# Altium project slave-18-ltc6813-1.PrjPcb (part 1 of 3)
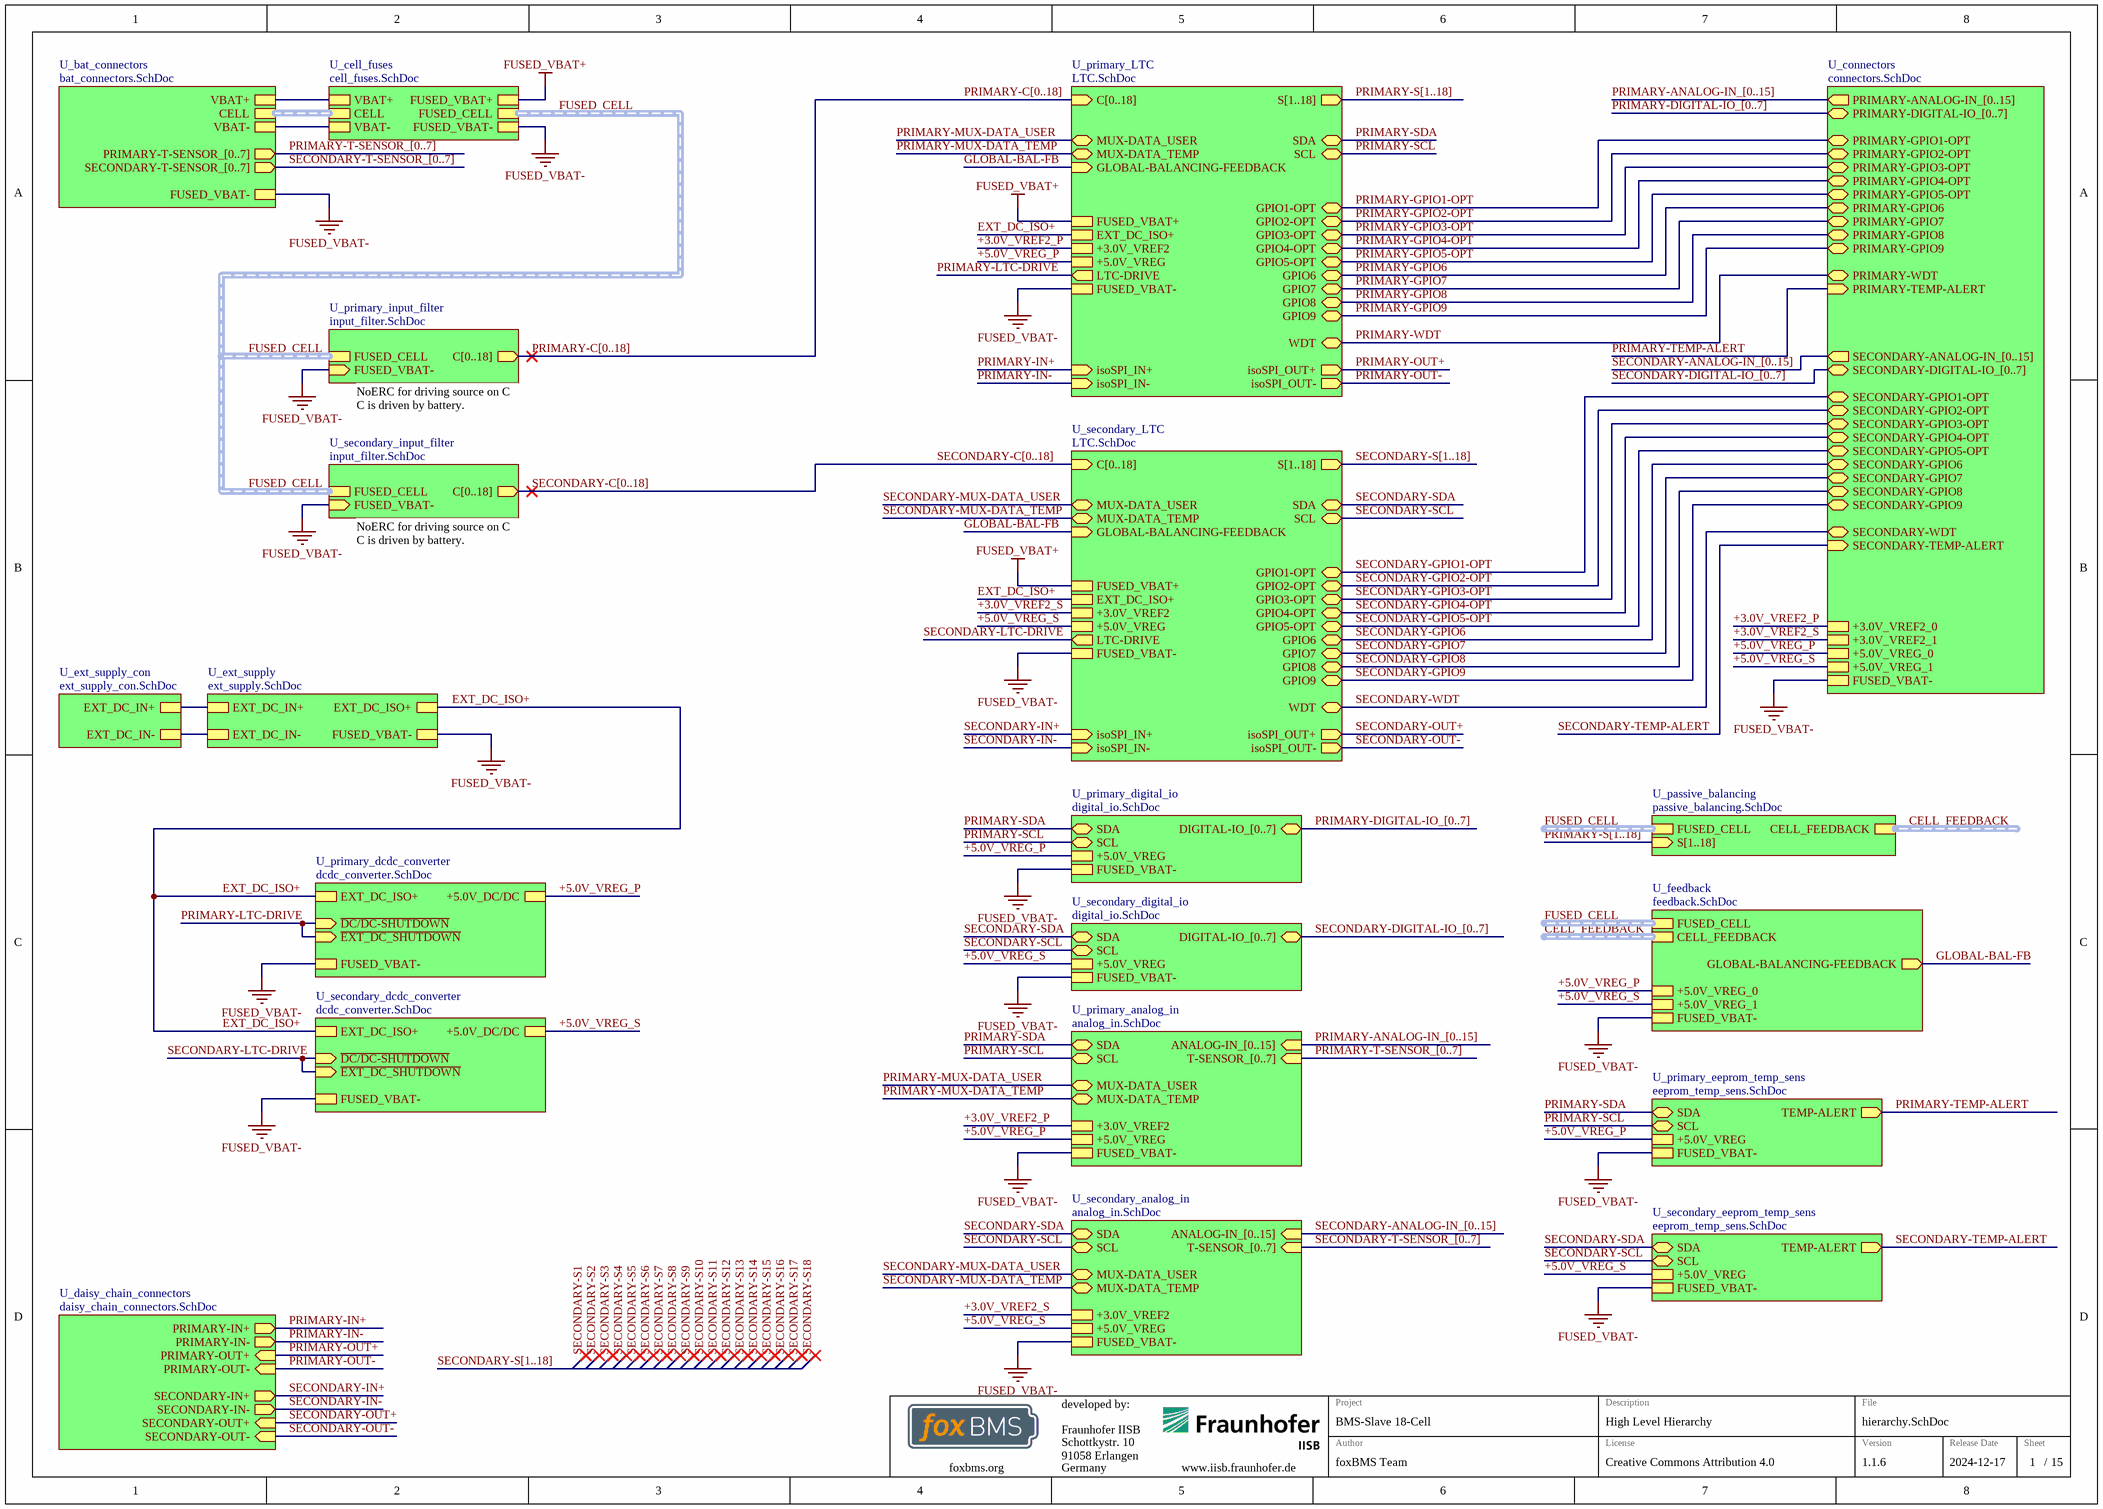
[diagram p0: hierarchy.SchDoc]
GlobalDate: 2024-12-17; GlobalLicense: Creative Commons Attribution 4.0; GlobalProject: BMS-Slave 18-Cell; GlobalVersion: 1.1.6
15 sheets, 578 parts. Net scope: strictly hierarchical (ports join the sheet entries above them; power ports are local).
Board file: slave.PcbDoc
Sheets:
  hierarchy.SchDoc
    U_cell_fuses = cell_fuses.SchDoc
    U_primary_input_filter = input_filter.SchDoc
    U_secondary_input_filter = input_filter.SchDoc
    U_ext_supply = ext_supply.SchDoc
    U_connectors = connectors.SchDoc
    U_feedback = feedback.SchDoc
    U_passive_balancing = passive_balancing.SchDoc
    U_primary_LTC = LTC.SchDoc
    U_secondary_digital_io = digital_io.SchDoc
    U_secondary_eeprom_temp_sens = eeprom_temp_sens.SchDoc
    U_secondary_analog_in = analog_in.SchDoc
    U_daisy_chain_connectors = daisy_chain_connectors.SchDoc
    U_ext_supply_con = ext_supply_con.SchDoc
    U_bat_connectors = bat_connectors.SchDoc
    U_primary_dcdc_converter = dcdc_converter.SchDoc
    U_secondary_dcdc_converter = dcdc_converter.SchDoc
    U_secondary_LTC = LTC.SchDoc
    U_primary_digital_io = digital_io.SchDoc
    U_primary_eeprom_temp_sens = eeprom_temp_sens.SchDoc
    U_primary_analog_in = analog_in.SchDoc

## Sheet hierarchy.SchDoc
size A3; SheetNumber: 1; SheetTotal: 15; SheetDescription: High Level Hierarchy

### Sub-sheets
U_bat_connectors = bat_connectors.SchDoc: CELL (harness CELL_VOLTAGES), PRIMARY-T-SENSOR_[0..7] (out), SECONDARY-T-SENSOR_[0..7] (out), VBAT+, VBAT-, FUSED_VBAT-
U_cell_fuses = cell_fuses.SchDoc: FUSED_CELL (harness CELL_VOLTAGES), CELL (harness CELL_VOLTAGES), VBAT+, VBAT-, FUSED_VBAT+, FUSED_VBAT-
U_connectors = connectors.SchDoc: PRIMARY-WDT (bidir), SECONDARY-WDT (bidir), PRIMARY-GPIO1-OPT (bidir), PRIMARY-GPIO2-OPT (bidir), PRIMARY-GPIO3-OPT (bidir), PRIMARY-GPIO4-OPT (bidir), PRIMARY-GPIO5-OPT (bidir), SECONDARY-GPIO1-OPT (bidir), SECONDARY-GPIO2-OPT (bidir), SECONDARY-GPIO3-OPT (bidir), SECONDARY-GPIO4-OPT (bidir), SECONDARY-GPIO5-OPT (bidir), PRIMARY-TEMP-ALERT (in), SECONDARY-TEMP-ALERT (in), SECONDARY-DIGITAL-IO_[0..7] (bidir), PRIMARY-DIGITAL-IO_[0..7] (bidir), PRIMARY-ANALOG-IN_[0..15] (out), SECONDARY-ANALOG-IN_[0..15] (out), PRIMARY-GPIO9 (bidir), PRIMARY-GPIO7 (bidir), PRIMARY-GPIO6 (bidir), PRIMARY-GPIO8 (bidir), SECONDARY-GPIO9 (bidir), SECONDARY-GPIO8 (bidir), SECONDARY-GPIO7 (bidir), SECONDARY-GPIO6 (bidir), +3.0V_VREF2_1, +5.0V_VREG_1, +3.0V_VREF2_0, FUSED_VBAT-, +5.0V_VREG_0
U_daisy_chain_connectors = daisy_chain_connectors.SchDoc: SECONDARY-IN+ (out), SECONDARY-IN- (out), SECONDARY-OUT+ (in), SECONDARY-OUT- (in), PRIMARY-IN+ (out), PRIMARY-IN- (out), PRIMARY-OUT- (in), PRIMARY-OUT+ (in)
U_ext_supply = ext_supply.SchDoc: EXT_DC_IN+, EXT_DC_IN-, EXT_DC_ISO+, FUSED_VBAT-
U_ext_supply_con = ext_supply_con.SchDoc: EXT_DC_IN+, EXT_DC_IN-
U_feedback = feedback.SchDoc: GLOBAL-BALANCING-FEEDBACK (out), CELL_FEEDBACK (harness CELL_FEEDBACK), FUSED_CELL (harness CELL_VOLTAGES), +5.0V_VREG_1, +5.0V_VREG_0, FUSED_VBAT-
U_passive_balancing = passive_balancing.SchDoc: FUSED_CELL (harness CELL_VOLTAGES), S[1..18] (in), CELL_FEEDBACK (harness CELL_FEEDBACK)
U_primary_analog_in = analog_in.SchDoc: MUX-DATA_TEMP (bidir), MUX-DATA_USER (bidir), ANALOG-IN_[0..15] (in), T-SENSOR_[0..7] (in), SCL (bidir), SDA (bidir), +5.0V_VREG, FUSED_VBAT-, +3.0V_VREF2
U_primary_dcdc_converter = dcdc_converter.SchDoc: +5.0V_DC/DC, FUSED_VBAT-, ~{DC/DC-SHUTDOWN} (in), EXT_DC_ISO+, ~{EXT_DC_SHUTDOWN} (in)
U_primary_digital_io = digital_io.SchDoc: SCL (bidir), SDA (bidir), DIGITAL-IO_[0..7] (bidir), +5.0V_VREG, FUSED_VBAT-
U_primary_eeprom_temp_sens = eeprom_temp_sens.SchDoc: TEMP-ALERT (out), SDA (bidir), SCL (bidir), FUSED_VBAT-, +5.0V_VREG
U_primary_input_filter = input_filter.SchDoc: FUSED_CELL (harness CELL_VOLTAGES), C[0..18] (out), FUSED_VBAT- (in)
U_primary_LTC = LTC.SchDoc: isoSPI_IN- (in), isoSPI_IN+ (in), isoSPI_OUT- (out), isoSPI_OUT+ (out), GPIO5-OPT (bidir), GPIO4-OPT (bidir), MUX-DATA_USER (bidir), GPIO1-OPT (bidir), SCL (bidir), GPIO2-OPT (bidir), MUX-DATA_TEMP (bidir), GPIO3-OPT (bidir), GLOBAL-BALANCING-FEEDBACK (in), SDA (bidir), EXT_DC_ISO+, C[0..18] (in), S[1..18] (out), WDT (bidir), GPIO8 (bidir), GPIO7 (bidir), GPIO9 (bidir), GPIO6 (bidir), FUSED_VBAT+, FUSED_VBAT-, +5.0V_VREG, +3.0V_VREF2, LTC-DRIVE (out)
U_secondary_analog_in = analog_in.SchDoc: MUX-DATA_TEMP (bidir), MUX-DATA_USER (bidir), ANALOG-IN_[0..15] (in), T-SENSOR_[0..7] (in), SCL (bidir), SDA (bidir), +5.0V_VREG, FUSED_VBAT-, +3.0V_VREF2
U_secondary_dcdc_converter = dcdc_converter.SchDoc: +5.0V_DC/DC, FUSED_VBAT-, ~{DC/DC-SHUTDOWN} (in), EXT_DC_ISO+, ~{EXT_DC_SHUTDOWN} (in)
U_secondary_digital_io = digital_io.SchDoc: SCL (bidir), SDA (bidir), DIGITAL-IO_[0..7] (bidir), +5.0V_VREG, FUSED_VBAT-
U_secondary_eeprom_temp_sens = eeprom_temp_sens.SchDoc: TEMP-ALERT (out), SDA (bidir), SCL (bidir), FUSED_VBAT-, +5.0V_VREG
U_secondary_input_filter = input_filter.SchDoc: FUSED_CELL (harness CELL_VOLTAGES), C[0..18] (out), FUSED_VBAT- (in)
U_secondary_LTC = LTC.SchDoc: isoSPI_IN- (in), isoSPI_IN+ (in), isoSPI_OUT- (out), isoSPI_OUT+ (out), GPIO5-OPT (bidir), GPIO4-OPT (bidir), MUX-DATA_USER (bidir), GPIO1-OPT (bidir), SCL (bidir), GPIO2-OPT (bidir), MUX-DATA_TEMP (bidir), GPIO3-OPT (bidir), GLOBAL-BALANCING-FEEDBACK (in), SDA (bidir), EXT_DC_ISO+, C[0..18] (in), S[1..18] (out), WDT (bidir), GPIO8 (bidir), GPIO7 (bidir), GPIO9 (bidir), GPIO6 (bidir), FUSED_VBAT+, FUSED_VBAT-, +5.0V_VREG, +3.0V_VREF2, LTC-DRIVE (out)

### Nets
+3.0V_VREF2_P: sheet U_connectors/+3.0V_VREF2_0, sheet U_primary_LTC/+3.0V_VREF2, sheet U_primary_analog_in/+3.0V_VREF2  [project net +3.0V_VREF2]
+3.0V_VREF2_S: sheet U_connectors/+3.0V_VREF2_1, sheet U_secondary_analog_in/+3.0V_VREF2, sheet U_secondary_LTC/+3.0V_VREF2  [project net +3.0V_VREF2]
+5.0V_VREG_P: sheet U_connectors/+5.0V_VREG_0, sheet U_feedback/+5.0V_VREG_0, sheet U_primary_LTC/+5.0V_VREG, sheet U_primary_dcdc_converter/+5.0V_DC/DC, sheet U_primary_digital_io/+5.0V_VREG, sheet U_primary_eeprom_temp_sens/+5.0V_VREG, sheet U_primary_analog_in/+5.0V_VREG  [project net +5.0V_VREG]
+5.0V_VREG_S: sheet U_connectors/+5.0V_VREG_1, sheet U_feedback/+5.0V_VREG_1, sheet U_secondary_digital_io/+5.0V_VREG, sheet U_secondary_eeprom_temp_sens/+5.0V_VREG, sheet U_secondary_analog_in/+5.0V_VREG, sheet U_secondary_dcdc_converter/+5.0V_DC/DC, sheet U_secondary_LTC/+5.0V_VREG  [project net +5.0V_VREG]
FUSED_VBAT+: sheet U_cell_fuses/FUSED_VBAT+, sheet U_primary_LTC/FUSED_VBAT+, sheet U_secondary_LTC/FUSED_VBAT+
FUSED_VBAT-: sheet U_cell_fuses/FUSED_VBAT-, sheet U_primary_input_filter/FUSED_VBAT-, sheet U_secondary_input_filter/FUSED_VBAT-, sheet U_ext_supply/FUSED_VBAT-, sheet U_connectors/FUSED_VBAT-, sheet U_feedback/FUSED_VBAT-, sheet U_primary_LTC/FUSED_VBAT-, sheet U_secondary_digital_io/FUSED_VBAT-, sheet U_secondary_eeprom_temp_sens/FUSED_VBAT-, sheet U_secondary_analog_in/FUSED_VBAT-, sheet U_bat_connectors/FUSED_VBAT-, sheet U_primary_dcdc_converter/FUSED_VBAT-, sheet U_secondary_dcdc_converter/FUSED_VBAT-, sheet U_secondary_LTC/FUSED_VBAT-, sheet U_primary_digital_io/FUSED_VBAT-, sheet U_primary_eeprom_temp_sens/FUSED_VBAT-, sheet U_primary_analog_in/FUSED_VBAT-
VBAT+: sheet U_cell_fuses/VBAT+, sheet U_bat_connectors/VBAT+
VBAT-: sheet U_cell_fuses/VBAT-, sheet U_bat_connectors/VBAT-
EXT_DC_IN+: sheet U_ext_supply/EXT_DC_IN+, sheet U_ext_supply_con/EXT_DC_IN+
EXT_DC_IN-: sheet U_ext_supply/EXT_DC_IN-, sheet U_ext_supply_con/EXT_DC_IN-
EXT_DC_ISO+: sheet U_ext_supply/EXT_DC_ISO+, sheet U_primary_LTC/EXT_DC_ISO+, sheet U_primary_dcdc_converter/EXT_DC_ISO+, sheet U_secondary_dcdc_converter/EXT_DC_ISO+, sheet U_secondary_LTC/EXT_DC_ISO+
GLOBAL-BAL-FB: sheet U_feedback/GLOBAL-BALANCING-FEEDBACK, sheet U_primary_LTC/GLOBAL-BALANCING-FEEDBACK, sheet U_secondary_LTC/GLOBAL-BALANCING-FEEDBACK
PRIMARY-GPIO1-OPT: sheet U_connectors/PRIMARY-GPIO1-OPT, sheet U_primary_LTC/GPIO1-OPT
PRIMARY-GPIO2-OPT: sheet U_connectors/PRIMARY-GPIO2-OPT, sheet U_primary_LTC/GPIO2-OPT
PRIMARY-GPIO3-OPT: sheet U_connectors/PRIMARY-GPIO3-OPT, sheet U_primary_LTC/GPIO3-OPT
PRIMARY-GPIO4-OPT: sheet U_connectors/PRIMARY-GPIO4-OPT, sheet U_primary_LTC/GPIO4-OPT
PRIMARY-GPIO5-OPT: sheet U_connectors/PRIMARY-GPIO5-OPT, sheet U_primary_LTC/GPIO5-OPT
PRIMARY-GPIO6: sheet U_connectors/PRIMARY-GPIO6, sheet U_primary_LTC/GPIO6
PRIMARY-GPIO7: sheet U_connectors/PRIMARY-GPIO7, sheet U_primary_LTC/GPIO7
PRIMARY-GPIO8: sheet U_connectors/PRIMARY-GPIO8, sheet U_primary_LTC/GPIO8
PRIMARY-GPIO9: sheet U_connectors/PRIMARY-GPIO9, sheet U_primary_LTC/GPIO9
PRIMARY-IN+: sheet U_primary_LTC/isoSPI_IN+, sheet U_daisy_chain_connectors/PRIMARY-IN+
PRIMARY-IN-: sheet U_primary_LTC/isoSPI_IN-, sheet U_daisy_chain_connectors/PRIMARY-IN-
PRIMARY-LTC-DRIVE: sheet U_primary_LTC/LTC-DRIVE, sheet U_primary_dcdc_converter/~{DC/DC-SHUTDOWN}, sheet U_primary_dcdc_converter/~{EXT_DC_SHUTDOWN}
PRIMARY-MUX-DATA_TEMP: sheet U_primary_LTC/MUX-DATA_TEMP, sheet U_primary_analog_in/MUX-DATA_TEMP
PRIMARY-MUX-DATA_USER: sheet U_primary_LTC/MUX-DATA_USER, sheet U_primary_analog_in/MUX-DATA_USER
PRIMARY-OUT+: sheet U_primary_LTC/isoSPI_OUT+, sheet U_daisy_chain_connectors/PRIMARY-OUT+
PRIMARY-OUT-: sheet U_primary_LTC/isoSPI_OUT-, sheet U_daisy_chain_connectors/PRIMARY-OUT-
PRIMARY-SCL: sheet U_primary_LTC/SCL, sheet U_primary_digital_io/SCL, sheet U_primary_eeprom_temp_sens/SCL, sheet U_primary_analog_in/SCL
PRIMARY-SDA: sheet U_primary_LTC/SDA, sheet U_primary_digital_io/SDA, sheet U_primary_eeprom_temp_sens/SDA, sheet U_primary_analog_in/SDA
PRIMARY-TEMP-ALERT: sheet U_connectors/PRIMARY-TEMP-ALERT, sheet U_primary_eeprom_temp_sens/TEMP-ALERT
PRIMARY-WDT: sheet U_connectors/PRIMARY-WDT, sheet U_primary_LTC/WDT
SECONDARY-GPIO1-OPT: sheet U_connectors/SECONDARY-GPIO1-OPT, sheet U_secondary_LTC/GPIO1-OPT
SECONDARY-GPIO2-OPT: sheet U_connectors/SECONDARY-GPIO2-OPT, sheet U_secondary_LTC/GPIO2-OPT
SECONDARY-GPIO3-OPT: sheet U_connectors/SECONDARY-GPIO3-OPT, sheet U_secondary_LTC/GPIO3-OPT
SECONDARY-GPIO4-OPT: sheet U_connectors/SECONDARY-GPIO4-OPT, sheet U_secondary_LTC/GPIO4-OPT
SECONDARY-GPIO5-OPT: sheet U_connectors/SECONDARY-GPIO5-OPT, sheet U_secondary_LTC/GPIO5-OPT
SECONDARY-GPIO6: sheet U_connectors/SECONDARY-GPIO6, sheet U_secondary_LTC/GPIO6
SECONDARY-GPIO7: sheet U_connectors/SECONDARY-GPIO7, sheet U_secondary_LTC/GPIO7
SECONDARY-GPIO8: sheet U_connectors/SECONDARY-GPIO8, sheet U_secondary_LTC/GPIO8
SECONDARY-GPIO9: sheet U_connectors/SECONDARY-GPIO9, sheet U_secondary_LTC/GPIO9
SECONDARY-IN+: sheet U_daisy_chain_connectors/SECONDARY-IN+, sheet U_secondary_LTC/isoSPI_IN+
SECONDARY-IN-: sheet U_daisy_chain_connectors/SECONDARY-IN-, sheet U_secondary_LTC/isoSPI_IN-
SECONDARY-LTC-DRIVE: sheet U_secondary_dcdc_converter/~{DC/DC-SHUTDOWN}, sheet U_secondary_dcdc_converter/~{EXT_DC_SHUTDOWN}, sheet U_secondary_LTC/LTC-DRIVE
SECONDARY-MUX-DATA_TEMP: sheet U_secondary_analog_in/MUX-DATA_TEMP, sheet U_secondary_LTC/MUX-DATA_TEMP
SECONDARY-MUX-DATA_USER: sheet U_secondary_analog_in/MUX-DATA_USER, sheet U_secondary_LTC/MUX-DATA_USER
SECONDARY-OUT+: sheet U_daisy_chain_connectors/SECONDARY-OUT+, sheet U_secondary_LTC/isoSPI_OUT+
SECONDARY-OUT-: sheet U_daisy_chain_connectors/SECONDARY-OUT-, sheet U_secondary_LTC/isoSPI_OUT-
SECONDARY-SCL: sheet U_secondary_digital_io/SCL, sheet U_secondary_eeprom_temp_sens/SCL, sheet U_secondary_analog_in/SCL, sheet U_secondary_LTC/SCL
SECONDARY-SDA: sheet U_secondary_digital_io/SDA, sheet U_secondary_eeprom_temp_sens/SDA, sheet U_secondary_analog_in/SDA, sheet U_secondary_LTC/SDA
SECONDARY-TEMP-ALERT: sheet U_connectors/SECONDARY-TEMP-ALERT, sheet U_secondary_eeprom_temp_sens/TEMP-ALERT
SECONDARY-WDT: sheet U_connectors/SECONDARY-WDT, sheet U_secondary_LTC/WDT

### Buses and harness runs
bus PRIMARY-ANALOG-IN_[0..15] = sheet U_connectors/PRIMARY-ANALOG-IN_[0..15]
bus PRIMARY-ANALOG-IN_[0..15] = sheet U_primary_analog_in/ANALOG-IN_[0..15]
bus PRIMARY-C[0..18] = sheet U_primary_input_filter/C[0..18] = sheet U_primary_LTC/C[0..18]
bus PRIMARY-DIGITAL-IO_[0..7] = sheet U_connectors/PRIMARY-DIGITAL-IO_[0..7]
bus PRIMARY-DIGITAL-IO_[0..7] = sheet U_primary_digital_io/DIGITAL-IO_[0..7]
bus PRIMARY-S[1..18] = sheet U_passive_balancing/S[1..18]
bus PRIMARY-S[1..18] = sheet U_primary_LTC/S[1..18]
bus PRIMARY-T-SENSOR_[0..7] = sheet U_bat_connectors/PRIMARY-T-SENSOR_[0..7]
bus PRIMARY-T-SENSOR_[0..7] = sheet U_primary_analog_in/T-SENSOR_[0..7]
bus SECONDARY-ANALOG-IN_[0..15] = sheet U_connectors/SECONDARY-ANALOG-IN_[0..15]
bus SECONDARY-ANALOG-IN_[0..15] = sheet U_secondary_analog_in/ANALOG-IN_[0..15]
bus SECONDARY-C[0..18] = sheet U_secondary_input_filter/C[0..18] = sheet U_secondary_LTC/C[0..18]
bus SECONDARY-DIGITAL-IO_[0..7] = sheet U_connectors/SECONDARY-DIGITAL-IO_[0..7]
bus SECONDARY-DIGITAL-IO_[0..7] = sheet U_secondary_digital_io/DIGITAL-IO_[0..7]
bus SECONDARY-S[1..18]
bus SECONDARY-S[1..18] = sheet U_secondary_LTC/S[1..18]
bus SECONDARY-T-SENSOR_[0..7] = sheet U_bat_connectors/SECONDARY-T-SENSOR_[0..7]
bus SECONDARY-T-SENSOR_[0..7] = sheet U_secondary_analog_in/T-SENSOR_[0..7]
harness CELL_FEEDBACK = sheet U_feedback/CELL_FEEDBACK
harness CELL_FEEDBACK = sheet U_passive_balancing/CELL_FEEDBACK
harness FUSED_CELL = sheet U_cell_fuses/FUSED_CELL = sheet U_primary_input_filter/FUSED_CELL = sheet U_secondary_input_filter/FUSED_CELL
harness FUSED_CELL = sheet U_feedback/FUSED_CELL
harness FUSED_CELL = sheet U_passive_balancing/FUSED_CELL
harness sheet U_bat_connectors/CELL = sheet U_cell_fuses/CELL

### Notes on the sheet
- NoERC for driving source on C
  C is driven by battery.
- Labels drawn without touching a wire or pin: SECONDARY-S1, SECONDARY-S2, SECONDARY-S3, SECONDARY-S4, SECONDARY-S5, SECONDARY-S6, SECONDARY-S7, SECONDARY-S8, SECONDARY-S9, SECONDARY-S10, SECONDARY-S11, SECONDARY-S12, SECONDARY-S13, SECONDARY-S14, SECONDARY-S15, SECONDARY-S16, SECONDARY-S17, SECONDARY-S18
- Fraunhofer IISB
- Schottkystr. 10
- developed by:
- 91058 Erlangen
- Germany
- Author
- Project
- License
- Description
- File
- Version
- Release Date
- Sheet
- foxbms.org <https://foxbms.org>
- www.iisb.fraunhofer.de <https://www.iisb.fraunhofer.de/>
- foxBMS Team
- /

## Sheet cell_fuses.SchDoc
size A3; SheetNumber: 3; SheetTotal: 15; SheetDescription: Cell Fuses
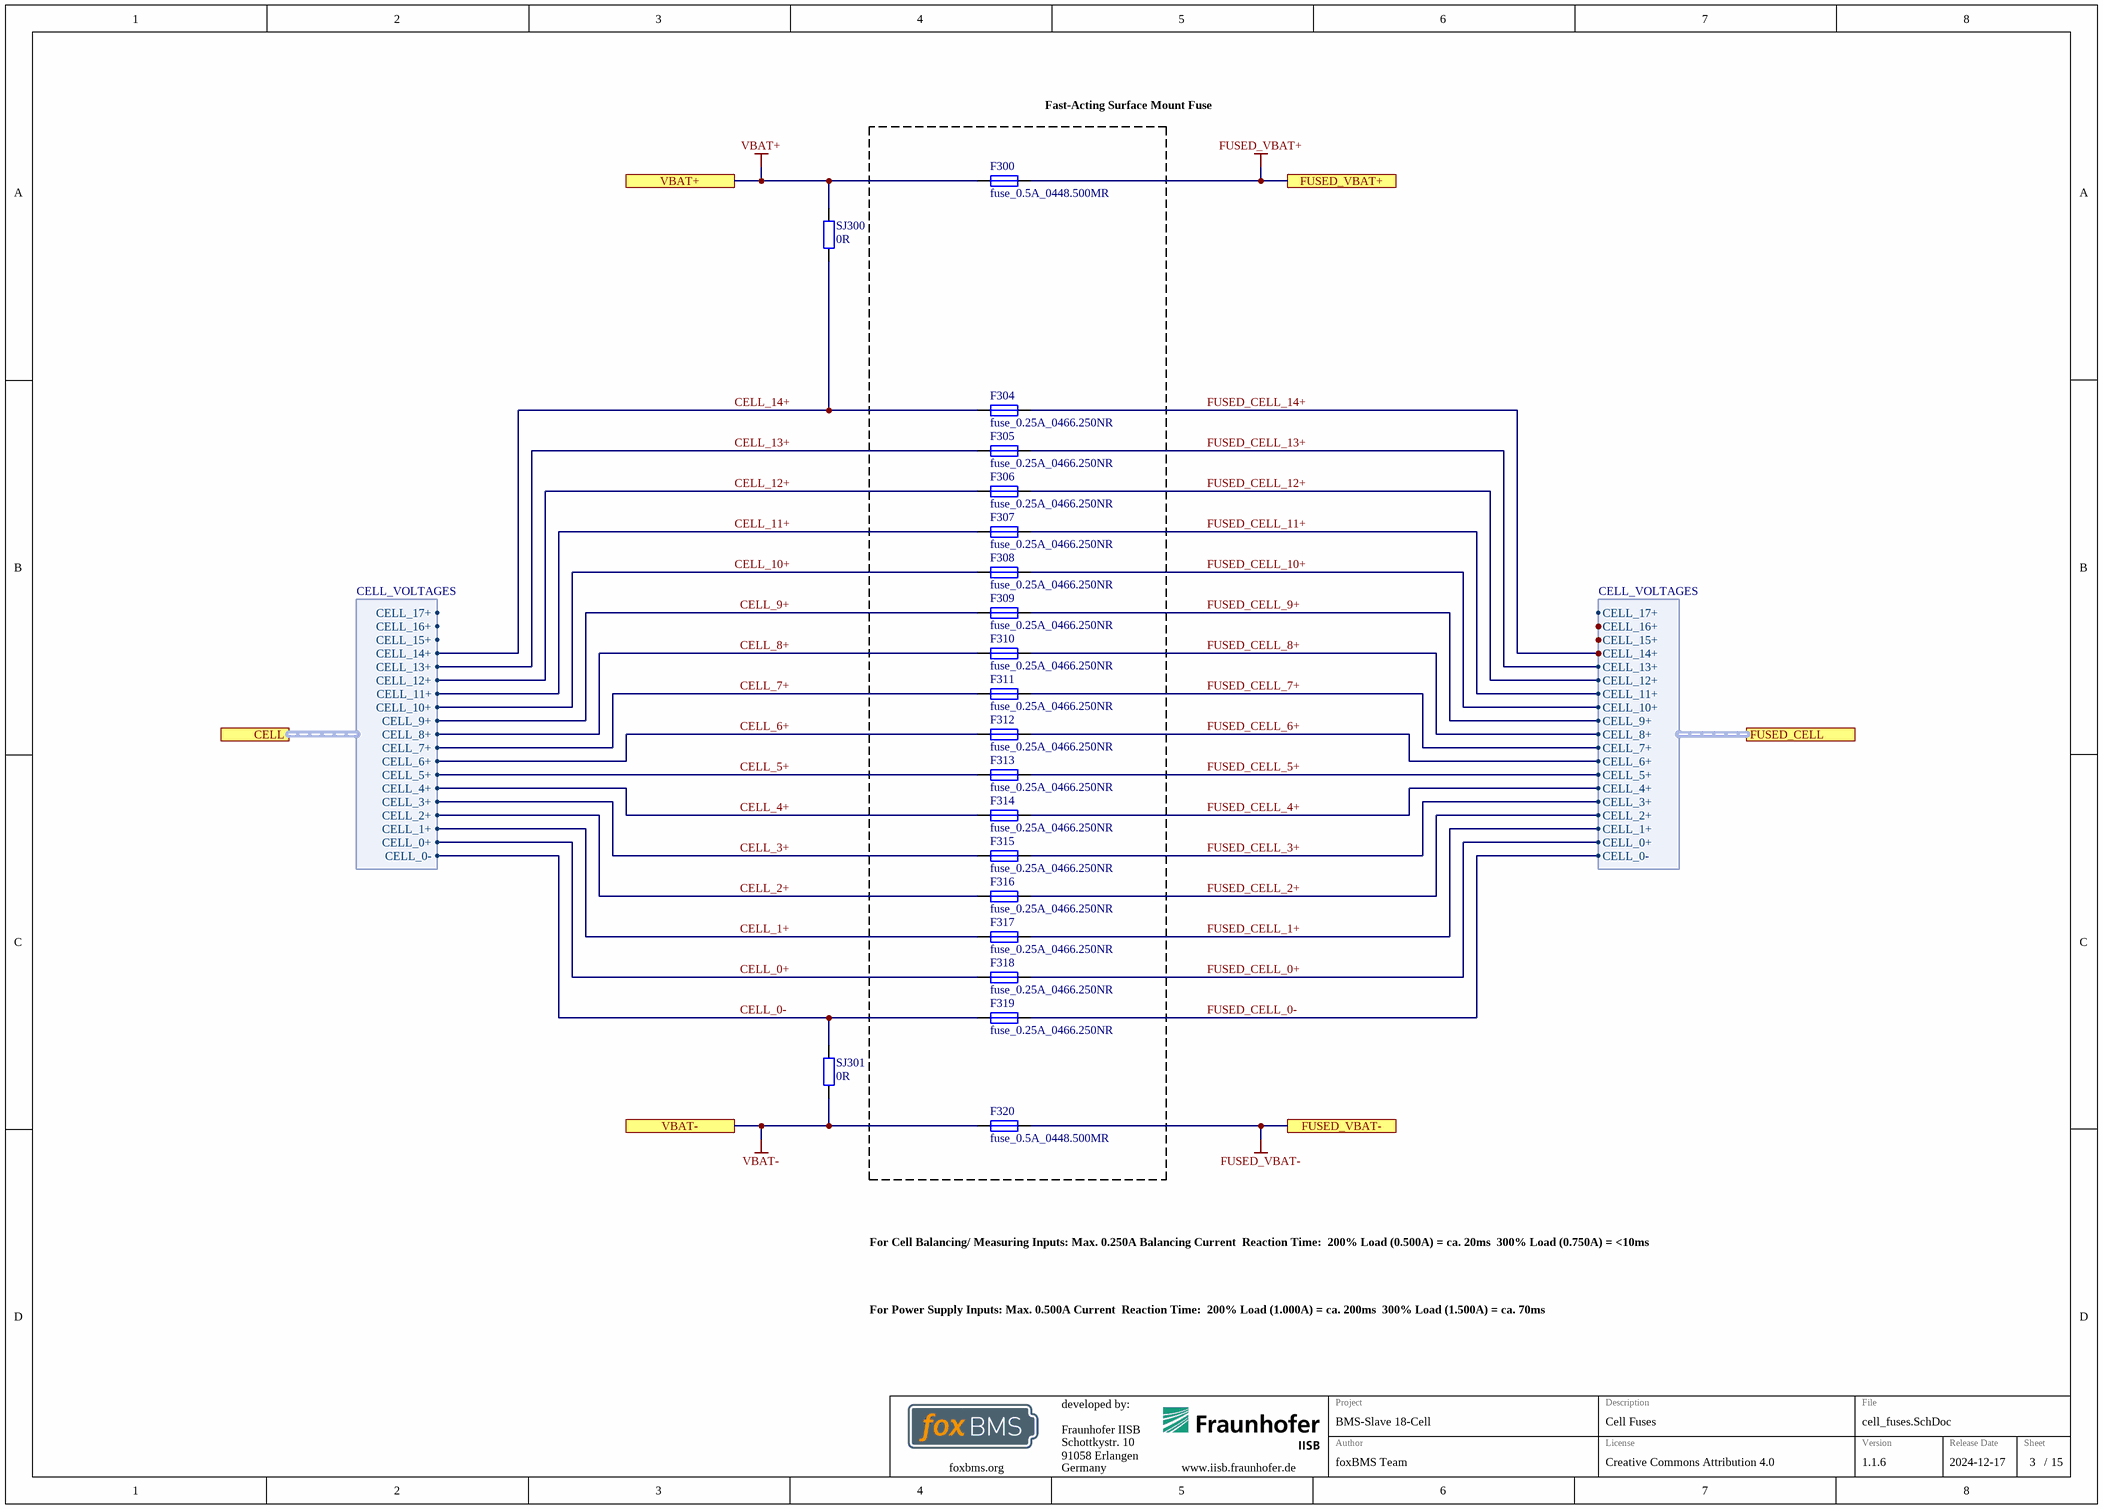
[diagram p1: cell_fuses.SchDoc]

### Parts
F300  fuse_0.5A_0448.500MR  [LITTLEFUSE_448]
F304  fuse_0.25A_0466.250NR  [LITTLEFUSE_466]
F305  fuse_0.25A_0466.250NR  [LITTLEFUSE_466]
F306  fuse_0.25A_0466.250NR  [LITTLEFUSE_466]
F307  fuse_0.25A_0466.250NR  [LITTLEFUSE_466]
F308  fuse_0.25A_0466.250NR  [LITTLEFUSE_466]
F309  fuse_0.25A_0466.250NR  [LITTLEFUSE_466]
F310  fuse_0.25A_0466.250NR  [LITTLEFUSE_466]
F311  fuse_0.25A_0466.250NR  [LITTLEFUSE_466]
F312  fuse_0.25A_0466.250NR  [LITTLEFUSE_466]
F313  fuse_0.25A_0466.250NR  [LITTLEFUSE_466]
F314  fuse_0.25A_0466.250NR  [LITTLEFUSE_466]
F315  fuse_0.25A_0466.250NR  [LITTLEFUSE_466]
F316  fuse_0.25A_0466.250NR  [LITTLEFUSE_466]
F317  fuse_0.25A_0466.250NR  [LITTLEFUSE_466]
F318  fuse_0.25A_0466.250NR  [LITTLEFUSE_466]
F319  fuse_0.25A_0466.250NR  [LITTLEFUSE_466]
F320  fuse_0.5A_0448.500MR  [LITTLEFUSE_448]
SJ300  0R  [RESC1608X05N]
SJ301  0R  [RESC1608X05N]

### Blocks framed on the sheet
Fast-Acting Surface Mount Fuse: F300 F304-F320

### Ports
CELL (harness CELL_VOLTAGES), FUSED_CELL (harness CELL_VOLTAGES), FUSED_VBAT+, FUSED_VBAT-, VBAT+, VBAT-

### Harnesses
CELL_VOLTAGES: CELL_0-, CELL_0+, CELL_1+, CELL_10+, CELL_11+, CELL_12+, CELL_13+, CELL_14+, CELL_15+, CELL_16+, CELL_17+, CELL_2+, CELL_3+, CELL_4+, CELL_5+, CELL_6+, CELL_7+, CELL_8+, CELL_9+

### Nets
FUSED_VBAT+: F300.2 ; port FUSED_VBAT+
FUSED_VBAT-: F320.2 ; port FUSED_VBAT-
VBAT+: F300.1 SJ300.1 ; port VBAT+
VBAT-: F320.1 SJ301.2 ; port VBAT-
CELL_0+: F318.1 ; port CELL.CELL_0+
CELL_0-: F319.1 SJ301.1 ; port CELL.CELL_0-
CELL_1+: F317.1 ; port CELL.CELL_1+
CELL_2+: F316.1 ; port CELL.CELL_2+
CELL_3+: F315.1 ; port CELL.CELL_3+
CELL_4+: F314.1 ; port CELL.CELL_4+
CELL_5+: F313.1 ; port CELL.CELL_5+
CELL_6+: F312.1 ; port CELL.CELL_6+
CELL_7+: F311.1 ; port CELL.CELL_7+
CELL_8+: F310.1 ; port CELL.CELL_8+
CELL_9+: F309.1 ; port CELL.CELL_9+
CELL_10+: F308.1 ; port CELL.CELL_10+
CELL_11+: F307.1 ; port CELL.CELL_11+
CELL_12+: F306.1 ; port CELL.CELL_12+
CELL_13+: F305.1 ; port CELL.CELL_13+
CELL_14+: F304.1 SJ300.2 ; port CELL.CELL_14+
FUSED_CELL_0+: F318.2 ; port FUSED_CELL.CELL_0+  [project net FUSED_CELL.CELL_0+]
FUSED_CELL_0-: F319.2 ; port FUSED_CELL.CELL_0-  [project net FUSED_CELL.CELL_0-]
FUSED_CELL_1+: F317.2 ; port FUSED_CELL.CELL_1+  [project net FUSED_CELL.CELL_1+]
FUSED_CELL_2+: F316.2 ; port FUSED_CELL.CELL_2+  [project net FUSED_CELL.CELL_2+]
FUSED_CELL_3+: F315.2 ; port FUSED_CELL.CELL_3+  [project net FUSED_CELL.CELL_3+]
FUSED_CELL_4+: F314.2 ; port FUSED_CELL.CELL_4+  [project net FUSED_CELL.CELL_4+]
FUSED_CELL_5+: F313.2 ; port FUSED_CELL.CELL_5+  [project net FUSED_CELL.CELL_5+]
FUSED_CELL_6+: F312.2 ; port FUSED_CELL.CELL_6+  [project net FUSED_CELL.CELL_6+]
FUSED_CELL_7+: F311.2 ; port FUSED_CELL.CELL_7+  [project net FUSED_CELL.CELL_7+]
FUSED_CELL_8+: F310.2 ; port FUSED_CELL.CELL_8+  [project net FUSED_CELL.CELL_8+]
FUSED_CELL_9+: F309.2 ; port FUSED_CELL.CELL_9+  [project net FUSED_CELL.CELL_9+]
FUSED_CELL_10+: F308.2 ; port FUSED_CELL.CELL_10+  [project net FUSED_CELL.CELL_10+]
FUSED_CELL_11+: F307.2 ; port FUSED_CELL.CELL_11+  [project net FUSED_CELL.CELL_11+]
FUSED_CELL_12+: F306.2 ; port FUSED_CELL.CELL_12+  [project net FUSED_CELL.CELL_12+]
FUSED_CELL_13+: F305.2 ; port FUSED_CELL.CELL_13+  [project net FUSED_CELL.CELL_13+]
FUSED_CELL_14+: F304.2 ; port FUSED_CELL.CELL_14+, port FUSED_CELL.CELL_15+, port FUSED_CELL.CELL_16+, port FUSED_CELL.CELL_17+  [project net FUSED_CELL.CELL_14+]

### Notes on the sheet
- For Cell Balancing/ Measuring Inputs: Max. 0.250A Balancing Current
  Reaction Time:
  200% Load (0.500A) = ca. 20ms
  300% Load (0.750A) = <10ms
- For Power Supply Inputs: Max. 0.500A Current
  Reaction Time:
  200% Load (1.000A) = ca. 200ms
  300% Load (1.500A) = ca. 70ms
- Fraunhofer IISB
- Schottkystr. 10
- developed by:
- 91058 Erlangen
- Germany
- Author
- Project
- License
- Description
- File
- Version
- Release Date
- Sheet
- foxbms.org <https://foxbms.org>
- www.iisb.fraunhofer.de <https://www.iisb.fraunhofer.de/>
- foxBMS Team
- /

### Library data of the parts
F300 F320 = fuse_0.5A_0448.500MR: Fuse, Surface Mount, NANO2 Series, 500 mA, 125 VAC, 32 VDC, Very Fast Acting, SMD; Manufacturer: Littlefuse; Automotive Qualified: False; Part Number: fuse_0.5A_0448.500MR; Operating Temperature: -55°C - +125°C; ComponentLink1Description: Datasheet; ComponentLink1URL: http://www.farnell.com/datasheets/1792947.pdf; Supplier 1: Farnell; Supplier Part Number 1: 1596919
F304-F319 = fuse_0.25A_0466.250NR: Fuse, Surface Mount, 466 Series, 250 mA, 125 VAC, 125 VDC, Very Fast Acting, 1206; Manufacturer: Littlefuse; Automotive Qualified: False; Part Number: fuse_0.25A_0466.250NR; Operating Temperature: -55°C - +90°C; ComponentLink1Description: Datasheet; ComponentLink1URL: http://www.farnell.com/datasheets/1796765.pdf; Supplier 1: Farnell; Supplier Part Number 1: 9921826
SJ300 SJ301 = gen_R_0R_0603: SMD Resistor 0R 0603; Power: 0.1W; Case EIA: 0603; Case Metric: 1608; Maximum Working Voltage: 75V; PnP Package: R_0603; Automotive Qualified: True; Part Number: gen_R_0R_0603; Operating Temperature: -55°C - +155°C; Resistance: 0R; Series: Jumper; PnP Value: 0R; Supplier 1: Farnell; Supplier Part Number 1: 2616580

## Sheet input_filter.SchDoc
size A3; SheetNumber: 4; SheetTotal: 15; SheetDescription: Input Filter
Used 2 times, as channels U_primary_input_filter, U_secondary_input_filter. Parts and nets are listed once, with the designators drawn on the sheet.
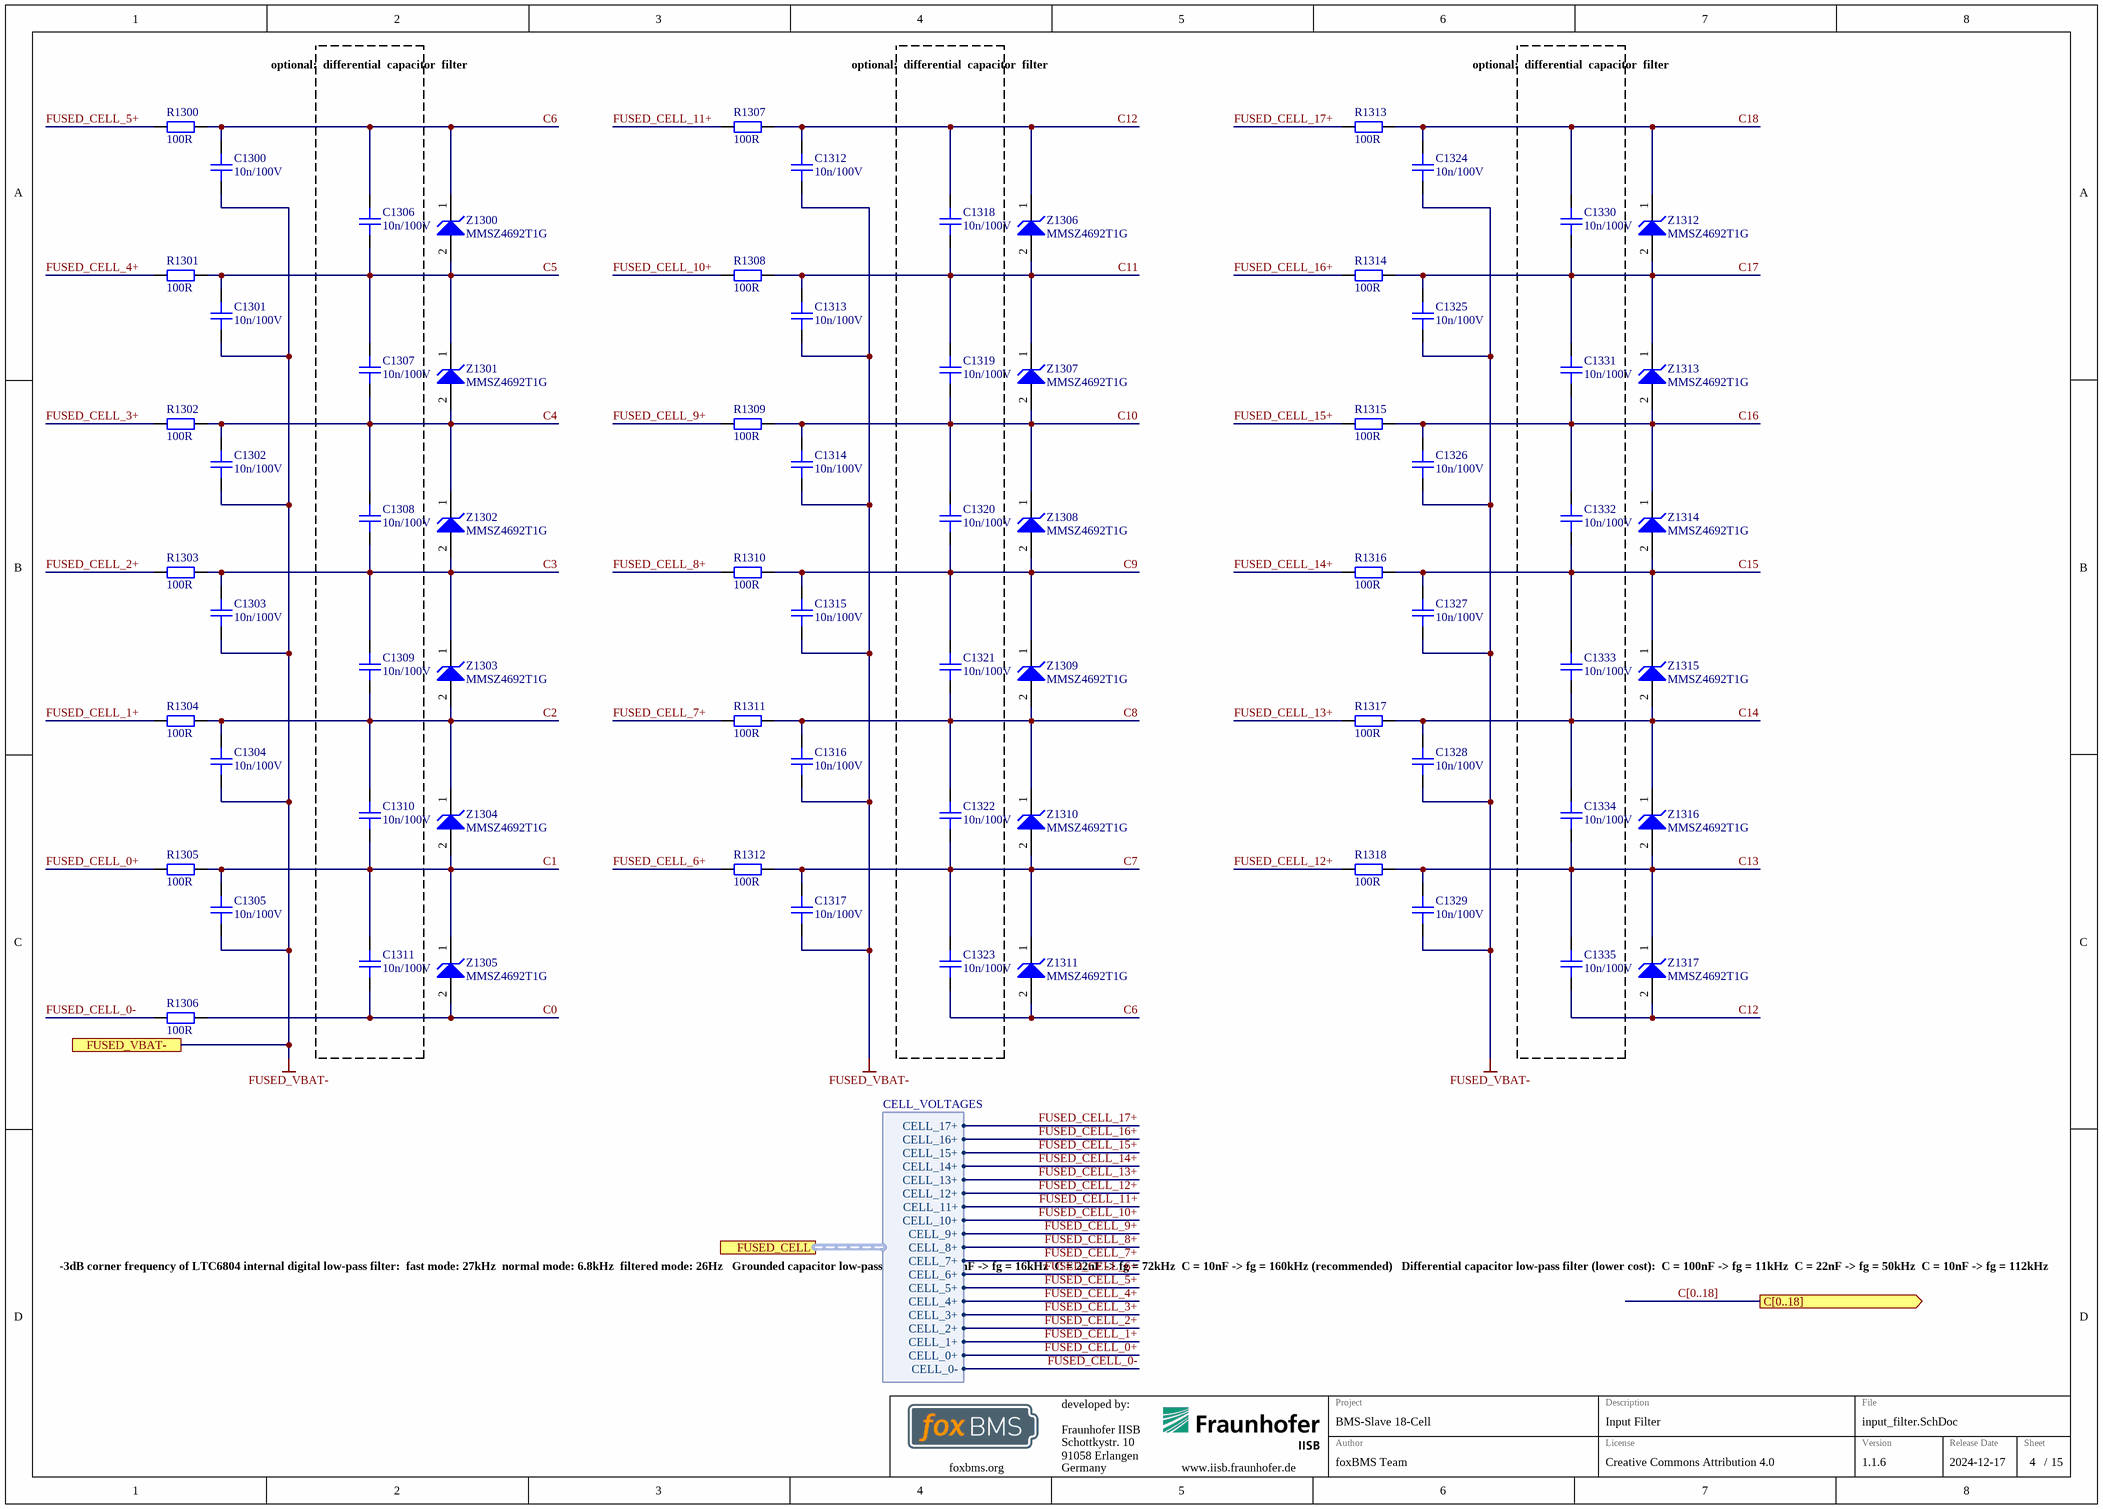
[diagram p2: input_filter.SchDoc]

### Parts
C1300  10n/100V  [CAPC1608X08N]
C1301  10n/100V  [CAPC1608X08N]
C1302  10n/100V  [CAPC1608X08N]
C1303  10n/100V  [CAPC1608X08N]
C1304  10n/100V  [CAPC1608X08N]
C1305  10n/100V  [CAPC1608X08N]
C1306  10n/100V  [CAPC1608X08N]
C1307  10n/100V  [CAPC1608X08N]
C1308  10n/100V  [CAPC1608X08N]
C1309  10n/100V  [CAPC1608X08N]
C1310  10n/100V  [CAPC1608X08N]
C1311  10n/100V  [CAPC1608X08N]
C1312  10n/100V  [CAPC1608X08N]
C1313  10n/100V  [CAPC1608X08N]
C1314  10n/100V  [CAPC1608X08N]
C1315  10n/100V  [CAPC1608X08N]
C1316  10n/100V  [CAPC1608X08N]
C1317  10n/100V  [CAPC1608X08N]
C1318  10n/100V  [CAPC1608X08N]
C1319  10n/100V  [CAPC1608X08N]
C1320  10n/100V  [CAPC1608X08N]
C1321  10n/100V  [CAPC1608X08N]
C1322  10n/100V  [CAPC1608X08N]
C1323  10n/100V  [CAPC1608X08N]
C1324  10n/100V  [CAPC1608X08N]
C1325  10n/100V  [CAPC1608X08N]
C1326  10n/100V  [CAPC1608X08N]
C1327  10n/100V  [CAPC1608X08N]
C1328  10n/100V  [CAPC1608X08N]
C1329  10n/100V  [CAPC1608X08N]
C1330  10n/100V  [CAPC1608X08N]
C1331  10n/100V  [CAPC1608X08N]
C1332  10n/100V  [CAPC1608X08N]
C1333  10n/100V  [CAPC1608X08N]
C1334  10n/100V  [CAPC1608X08N]
C1335  10n/100V  [CAPC1608X08N]
R1300  100R  [RESC1608X05N]
R1301  100R  [RESC1608X05N]
R1302  100R  [RESC1608X05N]
R1303  100R  [RESC1608X05N]
R1304  100R  [RESC1608X05N]
R1305  100R  [RESC1608X05N]
R1306  100R  [RESC1608X05N]
R1307  100R  [RESC1608X05N]
R1308  100R  [RESC1608X05N]
R1309  100R  [RESC1608X05N]
R1310  100R  [RESC1608X05N]
R1311  100R  [RESC1608X05N]
R1312  100R  [RESC1608X05N]
R1313  100R  [RESC1608X05N]
R1314  100R  [RESC1608X05N]
R1315  100R  [RESC1608X05N]
R1316  100R  [RESC1608X05N]
R1317  100R  [RESC1608X05N]
R1318  100R  [RESC1608X05N]
Z1300  MMSZ4692T1G  [ONSC-SOD-123-2-425-04_V]
Z1301  MMSZ4692T1G  [ONSC-SOD-123-2-425-04_V]
Z1302  MMSZ4692T1G  [ONSC-SOD-123-2-425-04_V]
Z1303  MMSZ4692T1G  [ONSC-SOD-123-2-425-04_V]
Z1304  MMSZ4692T1G  [ONSC-SOD-123-2-425-04_V]
Z1305  MMSZ4692T1G  [ONSC-SOD-123-2-425-04_V]
Z1306  MMSZ4692T1G  [ONSC-SOD-123-2-425-04_V]
Z1307  MMSZ4692T1G  [ONSC-SOD-123-2-425-04_V]
Z1308  MMSZ4692T1G  [ONSC-SOD-123-2-425-04_V]
Z1309  MMSZ4692T1G  [ONSC-SOD-123-2-425-04_V]
Z1310  MMSZ4692T1G  [ONSC-SOD-123-2-425-04_V]
Z1311  MMSZ4692T1G  [ONSC-SOD-123-2-425-04_V]
Z1312  MMSZ4692T1G  [ONSC-SOD-123-2-425-04_V]
Z1313  MMSZ4692T1G  [ONSC-SOD-123-2-425-04_V]
Z1314  MMSZ4692T1G  [ONSC-SOD-123-2-425-04_V]
Z1315  MMSZ4692T1G  [ONSC-SOD-123-2-425-04_V]
Z1316  MMSZ4692T1G  [ONSC-SOD-123-2-425-04_V]
Z1317  MMSZ4692T1G  [ONSC-SOD-123-2-425-04_V]

### Blocks framed on the sheet
optional: / differential / capacitor / filter: C1306-C1311
optional: / differential / capacitor / filter: C1318-C1323
optional: / differential / capacitor / filter: C1330-C1335

### Ports
C[0..18] (out), FUSED_CELL (harness CELL_VOLTAGES), FUSED_VBAT-

### Harnesses
CELL_VOLTAGES: CELL_0-, CELL_0+, CELL_1+, CELL_10+, CELL_11+, CELL_12+, CELL_13+, CELL_14+, CELL_15+, CELL_16+, CELL_17+, CELL_2+, CELL_3+, CELL_4+, CELL_5+, CELL_6+, CELL_7+, CELL_8+, CELL_9+

### Nets
FUSED_VBAT-: C1300.2 C1301.2 C1302.2 C1303.2 C1304.2 C1305.2 C1312.2 C1313.2 C1314.2 C1315.2 C1316.2 C1317.2 C1324.2 C1325.2 C1326.2 C1327.2 C1328.2 C1329.2 ; port FUSED_VBAT-
C0: C1311.2 R1306.2 Z1305.2(A)
C1: C1305.1 C1310.2 C1311.1 R1305.2 Z1304.2(A) Z1305.1(K)
C2: C1304.1 C1309.2 C1310.1 R1304.2 Z1303.2(A) Z1304.1(K)
C3: C1303.1 C1308.2 C1309.1 R1303.2 Z1302.2(A) Z1303.1(K)
C4: C1302.1 C1307.2 C1308.1 R1302.2 Z1301.2(A) Z1302.1(K)
C5: C1301.1 C1306.2 C1307.1 R1301.2 Z1300.2(A) Z1301.1(K)
C6: C1300.1 C1306.1 C1323.2 R1300.2 Z1300.1(K) Z1311.2(A)
C7: C1317.1 C1322.2 C1323.1 R1312.2 Z1310.2(A) Z1311.1(K)
C8: C1316.1 C1321.2 C1322.1 R1311.2 Z1309.2(A) Z1310.1(K)
C9: C1315.1 C1320.2 C1321.1 R1310.2 Z1308.2(A) Z1309.1(K)
C10: C1314.1 C1319.2 C1320.1 R1309.2 Z1307.2(A) Z1308.1(K)
C11: C1313.1 C1318.2 C1319.1 R1308.2 Z1306.2(A) Z1307.1(K)
C12: C1312.1 C1318.1 C1335.2 R1307.2 Z1306.1(K) Z1317.2(A)
C13: C1329.1 C1334.2 C1335.1 R1318.2 Z1316.2(A) Z1317.1(K)
C14: C1328.1 C1333.2 C1334.1 R1317.2 Z1315.2(A) Z1316.1(K)
C15: C1327.1 C1332.2 C1333.1 R1316.2 Z1314.2(A) Z1315.1(K)
C16: C1326.1 C1331.2 C1332.1 R1315.2 Z1313.2(A) Z1314.1(K)
C17: C1325.1 C1330.2 C1331.1 R1314.2 Z1312.2(A) Z1313.1(K)
C18: C1324.1 C1330.1 R1313.2 Z1312.1(K)
FUSED_CELL_0+: R1305.1 ; port FUSED_CELL.CELL_0+
FUSED_CELL_0-: R1306.1 ; port FUSED_CELL.CELL_0-
FUSED_CELL_1+: R1304.1 ; port FUSED_CELL.CELL_1+
FUSED_CELL_2+: R1303.1 ; port FUSED_CELL.CELL_2+
FUSED_CELL_3+: R1302.1 ; port FUSED_CELL.CELL_3+
FUSED_CELL_4+: R1301.1 ; port FUSED_CELL.CELL_4+
FUSED_CELL_5+: R1300.1 ; port FUSED_CELL.CELL_5+
FUSED_CELL_6+: R1312.1 ; port FUSED_CELL.CELL_6+
FUSED_CELL_7+: R1311.1 ; port FUSED_CELL.CELL_7+
FUSED_CELL_8+: R1310.1 ; port FUSED_CELL.CELL_8+
FUSED_CELL_9+: R1309.1 ; port FUSED_CELL.CELL_9+
FUSED_CELL_10+: R1308.1 ; port FUSED_CELL.CELL_10+
FUSED_CELL_11+: R1307.1 ; port FUSED_CELL.CELL_11+
FUSED_CELL_12+: R1318.1 ; port FUSED_CELL.CELL_12+
FUSED_CELL_13+: R1317.1 ; port FUSED_CELL.CELL_13+
FUSED_CELL_14+: R1316.1 ; port FUSED_CELL.CELL_14+
FUSED_CELL_15+: R1315.1 ; port FUSED_CELL.CELL_15+
FUSED_CELL_16+: R1314.1 ; port FUSED_CELL.CELL_16+
FUSED_CELL_17+: R1313.1 ; port FUSED_CELL.CELL_17+

### Channels
U_primary_input_filter: designators end in _1; ports FUSED_VBAT-=FUSED_VBAT-
U_secondary_input_filter: designators end in _2; ports FUSED_VBAT-=FUSED_VBAT-

### Buses and harness runs
bus C[0..18] = port C[0..18]

### Notes on the sheet
- -3dB corner frequency of LTC6804 internal digital low-pass filter:
  fast mode: 27kHz
  normal mode: 6.8kHz
  filtered mode: 26Hz
  Grounded capacitor low-pass filter:
  C = 100nF -> fg = 16kHz
  C = 22nF -> fg = 72kHz
  C = 10nF -> fg = 160kHz (recommended)
  Differential capacitor low-pass filter (lower cost):
  C = 100nF -> fg = 11kHz
  C = 22nF -> fg = 50kHz
  C = 10nF -> fg = 112kHz
- Fraunhofer IISB
- Schottkystr. 10
- developed by:
- 91058 Erlangen
- Germany
- Author
- Project
- License
- Description
- File
- Version
- Release Date
- Sheet
- foxbms.org <https://foxbms.org>
- www.iisb.fraunhofer.de <https://www.iisb.fraunhofer.de/>
- foxBMS Team
- /

### Library data of the parts
C1300-C1335 = gen_C_ceramic_10n_100V_X7R_0603: MLCC; Capacitance: 10n; Rated Voltage: 100V; Dielectric: X7R; Case EIA: 0603; Case Metric: 1608; Automotive Qualified: True; Part Number: gen_C_ceramic_10n_100V_X7R_0603; Supplier 1: Farnell; Supplier Part Number 1: 1301715; Supplier 2: Farnell; Supplier Part Number 2: 2821192; Supplier 3: Farnell; Supplier Part Number 3: 2210878
R1300-R1318 = gen_R_100R_0603: SMD Resistor 100R 0603; Tolerance: 1%; Power: 0.1W; Case EIA: 0603; Case Metric: 1608; Maximum Working Voltage: 75V; PnP Package: R_0603; Automotive Qualified: True; Part Number: gen_R_100R_0603; Operating Temperature: -55°C - +155°C; Resistance: 100R; Series: E24, E96; PnP Value: 100R; Supplier 1: Farnell; Supplier Part Number 1: 2303059
Z1300-Z1317 = CMP-1060-00434-1: Zener Voltage Regulator, 500 mW, 2-Pin SOD-123, Pb-Free, Tape and Reel; Manufacturer: On Semiconductor; VZ Typ (V): 6.8; P Max (W): 0.5; ComponentLink2URL: http://www.onsemi.com/pub_link/Collateral/MMSZ4678T1-D.PDF; Mounting Technology: Surface Mount; DatasheetVersion: Rev. 9; ComponentLink1Description: Manufacturer URL; ComponentLink3URL: http://www.onsemi.com/pub_link/Collateral/425-04.PDF; PackageReference: SOD-123-2-425-04; ComponentLink2Description: Datasheet; RoHS: Pb-Free; Packing: Tape and Reel; ComponentLink1URL: http://www.onsemi.com/; PackageDescription: 2-Pin SOD, Body 1.6 x 2.69 mm; ComponentLink3Description: Package Specification; PartNumber: MMSZ4692T1G; PackageVersion: Rev. G, 10/2009

## Sheet ext_supply.SchDoc
size A3; SheetNumber: 11; SheetTotal: 15; SheetDescription: External Supply
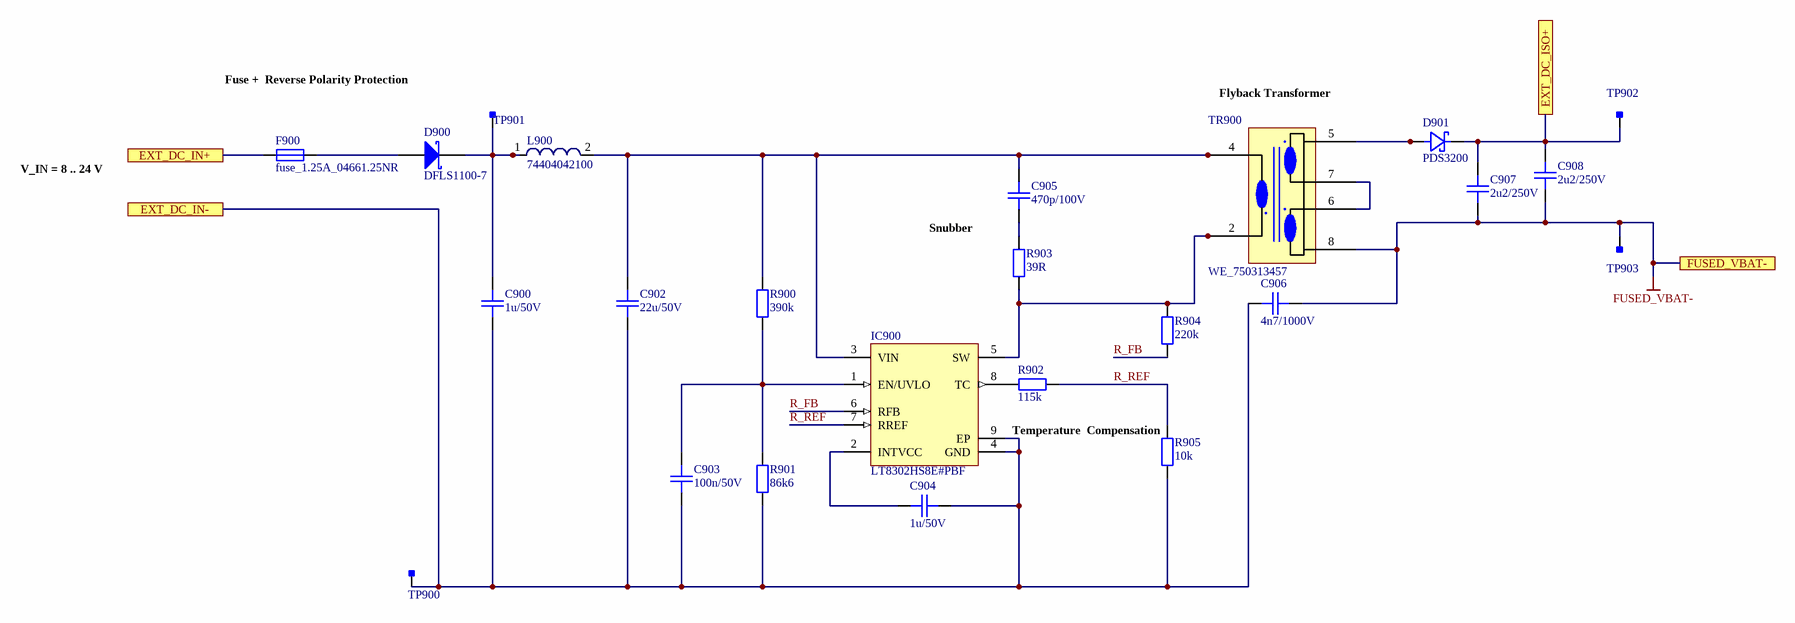
[diagram p3: ext_supply.SchDoc]

### Parts
C900  1u/50V  [CAPC2012X14N]
C902  22u/50V  [CAPC2220(5750)230_N]
C903  100n/50V  [CAPC1608X08N]
C904  1u/50V  [CAPC2012X14N]
C905  470p/100V  [CAPC2012X14N]
C906  4n7/1000V  [CAPC4532X16N]
C907  2u2/250V  [CAPC2220(5750)230_N]
C908  2u2/250V  [CAPC2220(5750)230_N]
D900  DFLS1100-7  [DIOD-POWERDI123-2_V]
D901  PDS3200  [PowerDI5]
F900  fuse_1.25A_04661.25NR  [LITTLEFUSE_466]
IC900  LT8302HS8E#PBF  [LT-S8E-8_V]
L900  74404042100  [WE-LQS 4018]
R900  390k  [RESC1608X05N]
R901  86k6  [RESC1608X05N]
R902  115k  [RESC1608X05N]
R903  39R  [RESC2012X05N]
R904  220k  [RESC1608X05N]
R905  10k  [RESC1608X05N]
TP900  Testpoint_Square  [Testpoint_S1]  (value not drawn)  (no BOM)
TP901  Testpoint_Square  [Testpoint_S1]  (value not drawn)  (no BOM)
TP902  Testpoint_Square  [Testpoint_S1]  (value not drawn)  (no BOM)
TP903  Testpoint_Square  [Testpoint_S1]  (value not drawn)  (no BOM)
TR900  WE_750313457  [WE_750313457]

### Ports
EXT_DC_IN+, EXT_DC_IN-, EXT_DC_ISO+, FUSED_VBAT-

### Nets
FUSED_VBAT-: C906.2 C907.1 C908.1 TP903.1 TR900.8 ; port FUSED_VBAT-
EXT_DC_IN+: F900.1 ; port EXT_DC_IN+
EXT_DC_IN-: C900.1 C902.1 C903.1 C904.1 C906.1 IC900.4(GND) IC900.9(EP) R901.1 R905.1 TP900.1 ; port EXT_DC_IN-
EXT_DC_ISO+: C907.2 C908.2 D901.1(C) TP902.1 ; port EXT_DC_ISO+
R_FB: IC900.6(RFB) R904.1
R_REF: IC900.7(RREF) R902.2 R905.2
NetC900_2: C900.2 D900.2(K) L900.1 TP901.1
NetC902_2: C902.2 C905.2 IC900.3(VIN) L900.2 R900.2 TR900.3 TR900.4
NetC903_2: C903.2 IC900.1(EN/UVLO) R900.1 R901.2
NetC904_2: C904.2 IC900.2(INTVCC)
NetC905_1: C905.1 R903.2
NetD900_1: D900.1(A) F900.2
NetD901_2: D901.2(A) D901.3(A) TR900.5
NetIC900_5: IC900.5(SW) R903.1 R904.2 TR900.1 TR900.2
NetIC900_8: IC900.8(TC) R902.1
NetTR900_6: TR900.6 TR900.7

### Notes on the sheet
- Fuse +
  Reverse Polarity Protection
- (near TR900) Flyback Transformer
- V_IN = 8 .. 24 V
- Snubber
- (near R905) Temperature
  Compensation
- Fraunhofer IISB
- Schottkystr. 10
- developed by:
- 91058 Erlangen
- Germany
- Author
- Project
- License
- Description
- File
- Version
- Release Date
- Sheet
- foxbms.org <https://foxbms.org>
- www.iisb.fraunhofer.de <https://www.iisb.fraunhofer.de/>
- foxBMS Team
- /

### Library data of the parts
C900 C904 = gen_C_ceramic_1u_50V_X7R_0805: MLCC; Capacitance: 1u; Rated Voltage: 50V; Dielectric: X7R; Case EIA: 0805; Case Metric: 2012; Automotive Qualified: True; Tolerance: ± 10%; AVT Set: x; Part Number: gen_C_ceramic_1u_50V_X7R_0805; Supplier 1: Farnell; Supplier Part Number 1: 2672199; Operating Temperature: -55°C - +125°C; Supplier 2: Farnell; Supplier Part Number 2: 2479894; Supplier 3: Farnell; Supplier Part Number 3: 2464630
C902 = gen_C_ceramic_22u_50V_X7R_2220_stacked: MLCC; Capacitance: 22u; Rated Voltage: 50V; Dielectric: X7R; Case EIA: 2220; Case Metric: 5750; Automotive Qualified: True; Part Number: gen_C_ceramic_22u_50V_X7R_2220_stacked; Supplier 1: Digikey; Supplier Part Number 1: 399-5797-1-ND
C903 = gen_C_ceramic_100n_50V_X7R_0603: MLCC; Capacitance: 100n; Rated Voltage: 50V; Dielectric: X7R; Case EIA: 0603; Case Metric: 1608; PnP Package: C_0603_10; PnP Value: 100n/50V/X7R; PnP equipped: x; Automotive Qualified: True; Part Number: gen_C_ceramic_100n_50V_X7R_0603; Supplier 1: Farnell; Supplier Part Number 1: 2525267; Supplier 2: Digikey; Supplier Part Number 2: 490-6049-1-ND; Supplier 3: Farnell; Supplier Part Number 3: 2070398
C905 = gen_C_ceramic_470p_100V_X7R_0805: MLCC; Capacitance: 470p; Rated Voltage: 100V; Dielectric: X7R; Case EIA: 0805; Case Metric: 2012; Automotive Qualified: True; Part Number: gen_C_ceramic_470p_100V_X7R_0805; Supplier 1: Farnell; Supplier Part Number 1: 2070482
C906 = gen_C_ceramic_4n7_1000V_X7R_1812: MLCC; Capacitance: 4n7; Rated Voltage: 1000V; Dielectric: X7R; Case EIA: 1812; Case Metric: 4532; Automotive Qualified: True; Part Number: gen_C_ceramic_4n7_1000V_X7R_1812; Supplier 1: Farnell; Supplier Part Number 1: 2834565
C907 C908 = gen_C_ceramic_2u2_250V_X7R_2220: MLCC; Capacitance: 2u2; Rated Voltage: 250V; Dielectric: X7R; Case EIA: 2220; Case Metric: 5750; Automotive Qualified: True; Part Number: gen_C_ceramic_2u2_250V_X7R_2220; Supplier 1: Digikey; Supplier Part Number 1: 445-7997-2-ND
D900 = CMP-2000-05099-1: 1 A High Voltage Schottky Barrier Rectifier, 0.62 V, -55 to 175 degC, 2- Pin POWERDI123, Pb-Free, Tape and Reel; Manufacturer: Diodes Inc; Average Rectified Current-Max: 1A; Peak Current-Max: 40A; Forward Voltage: 0.77V; Reverse Current-Max: 1µA; Reverse Voltage-Max [Vrrm]: 100V; Datasheet Version: Sep-14; Datasheet URL: https://datasheet.ciiva.com/15144/getdatasheetpartid-44146-15144126.pdf; Manufacturer URL: http://www.diodes.com/
D901 = PDS3200-13: Schottky Diode 3A 200V 780mV; Manufacturer: DIODES Inc; Automotive Qualified: True; Part Number: PDS3200-13; Part Name: PDS3200; Operating Temperature: -65°C - +150°C; Breakdown Voltage: 200V; Continuous Forward Current: 3A; ComponentLink1Description: Datasheet; ComponentLink1URL: http://www.farnell.com/datasheets/2238298.pdf; Supplier 1: Farnell; Supplier Part Number 1: 1713904
F900 = fuse_1.25A_04661.25NR: Fuse, Surface Mount, 466 Series, 1.25 A, 63 VAC, 63 VDC, Very Fast Acting, 1206; Manufacturer: Littlefuse; Automotive Qualified: False; Part Number: fuse_1.25A_04661.25NR; Operating Temperature: -55°C - +90°C; ComponentLink1Description: Datasheet; ComponentLink1URL: http://www.farnell.com/datasheets/1796765.pdf; Supplier 1: Farnell; Supplier Part Number 1: 1596526
IC900 = CMP-0492-02715-1: Micropower No-Opto Isolated Flyback Converter, 2.8 to 42 V, -40 to 150 degC, 8-Pin SOIC (S8E), RoHS, Tube; PartNumber: LT8302; Output Current: 3.6 A; Number of Outputs: 1; VIN Min: 2.8 V; VIN Max: 42 V; ComponentLink2Description: Datasheet; Temperature Min: -40 degC; PackageDescription: 8-Pin Plastic Small Outline Integrated Circuit Package, Body 4.90 x 3.90 mm, Pitch 1.27 mm; Temperature Max: 150 degC; ComponentLink1URL: http://www.linear.com/; ComponentLink3URL: http://cds.linear.com/docs/en/packaging/05081857_A_S8E.pdf; PackageVersion: Rev. A, 10/2013; Packing: Tube; RoHS: TRUE; DatasheetVersion: Rev. A; ComponentLink2URL: http://cds.linear.com/docs/en/datasheet/8302fa.pdf; Mounting Technology: Surface Mount; ComponentLink1Description: Manufacturer URL; ComponentLink3Description: Package Specification
L900 = CMP-1354-00028-1: WE-LQS SMD Power Inductor, L=10 µH; Manufacturer: Wuerth Elektronik; Inductance: 10 ÂµH; ComponentLink2URL: http://katalog.we-online.de/pbs/datasheet/74404042100.pdf; PartNumber: 74404042100; ComponentLink2Description: Datasheet; PackageReference: WE-LQS 4018; ComponentLink1URL: http://www.we-online.com; ComponentLink1Description: Manufacturer URL
R900 = gen_R_390k_0603: SMD Resistor 390k 0603; Tolerance: 1%; Power: 0.1W; Case EIA: 0603; Case Metric: 1608; Maximum Working Voltage: 75V; PnP Package: R_0603; Automotive Qualified: True; Part Number: gen_R_390k_0603; Operating Temperature: -55°C - +155°C; Resistance: 390k; Series: E24; PnP Value: 390k; Supplier 1: Farnell; Supplier Part Number 1: 2303278
R901 = gen_R_86k6_0603: SMD Resistor 86k6 0603; Tolerance: 1%; Power: 0.1W; Case EIA: 0603; Case Metric: 1608; Maximum Working Voltage: 75V; PnP Package: R_0603; Automotive Qualified: True; Part Number: gen_R_86k6_0603; Operating Temperature: -55°C - +155°C; Resistance: 86k6; Series: E96; PnP Value: 86k6; Supplier 1: Farnell; Supplier Part Number 1: 2059490
R902 = gen_R_115k_0603: SMD Resistor 115k 0603; Tolerance: 1%; Power: 0.1W; Case EIA: 0603; Case Metric: 1608; Maximum Working Voltage: 75V; PnP Package: R_0603; Automotive Qualified: True; Part Number: gen_R_115k_0603; Operating Temperature: -55°C - +155°C; Resistance: 115k; Series: E96; PnP Value: 115k; Supplier 1: Farnell; Supplier Part Number 1: 2073367
R903 = gen_R_39R_0805: SMD Resistor 39R 0805; Tolerance: 1%; Power: 0.125W; Case EIA: 0805; Case Metric: 2012; Maximum Working Voltage: 150V; PnP Package: R_0805; Automotive Qualified: True; Part Number: gen_R_39R_0805; Operating Temperature: -55°C - +155°C; Resistance: 39R; Series: E24; PnP Value: 39R; Supplier 1: Farnell; Supplier Part Number 1: 1750736
R904 = gen_R_220k_0603: SMD Resistor 220k 0603; Tolerance: 1%; Power: 0.1W; Case EIA: 0603; Case Metric: 1608; Maximum Working Voltage: 75V; PnP Package: R_0603; Automotive Qualified: False; Part Number: gen_R_220k_0603; Operating Temperature: -55°C - +155°C; Resistance: 220k; Series: E24; PnP Value: 220k
R905 = gen_R_10k_0603: SMD Resistor 10k 0603; Tolerance: 1%; Power: 0.1W; Case EIA: 0603; Case Metric: 1608; Maximum Working Voltage: 75V; PnP Package: R_0603; Automotive Qualified: True; Part Number: gen_R_10k_0603; Operating Temperature: -55°C - +155°C; Resistance: 10k; Series: E24, E96; PnP Value: 10k; Supplier 1: Farnell; Supplier Part Number 1: 2073349
TP900-TP903 = Testpoint_Square: Testpoint, square; Part Number: Testpoint_Square
TR900 = WE_750313457: MID-FLYLT Flyback Transformers for Linear Technology; Manufacturer: Würth Elektronik; Automotive Qualified: False; Part Number: WE_750313457; ComponentLink1Description: Datasheet; ComponentLink1URL: http://katalog.we-online.de/ctm/datasheet/750313457.pdf; ComponentLink2Description: Website; ComponentLink2URL: http://katalog.we-online.de/en/ctm/MID-FLYLT/750313457; Supplier 1: Digikey; Supplier Part Number 1: 1297-1136-1-ND

## Sheet connectors.SchDoc
size A3; SheetNumber: 10; SheetTotal: 15; SheetDescription: Connectors
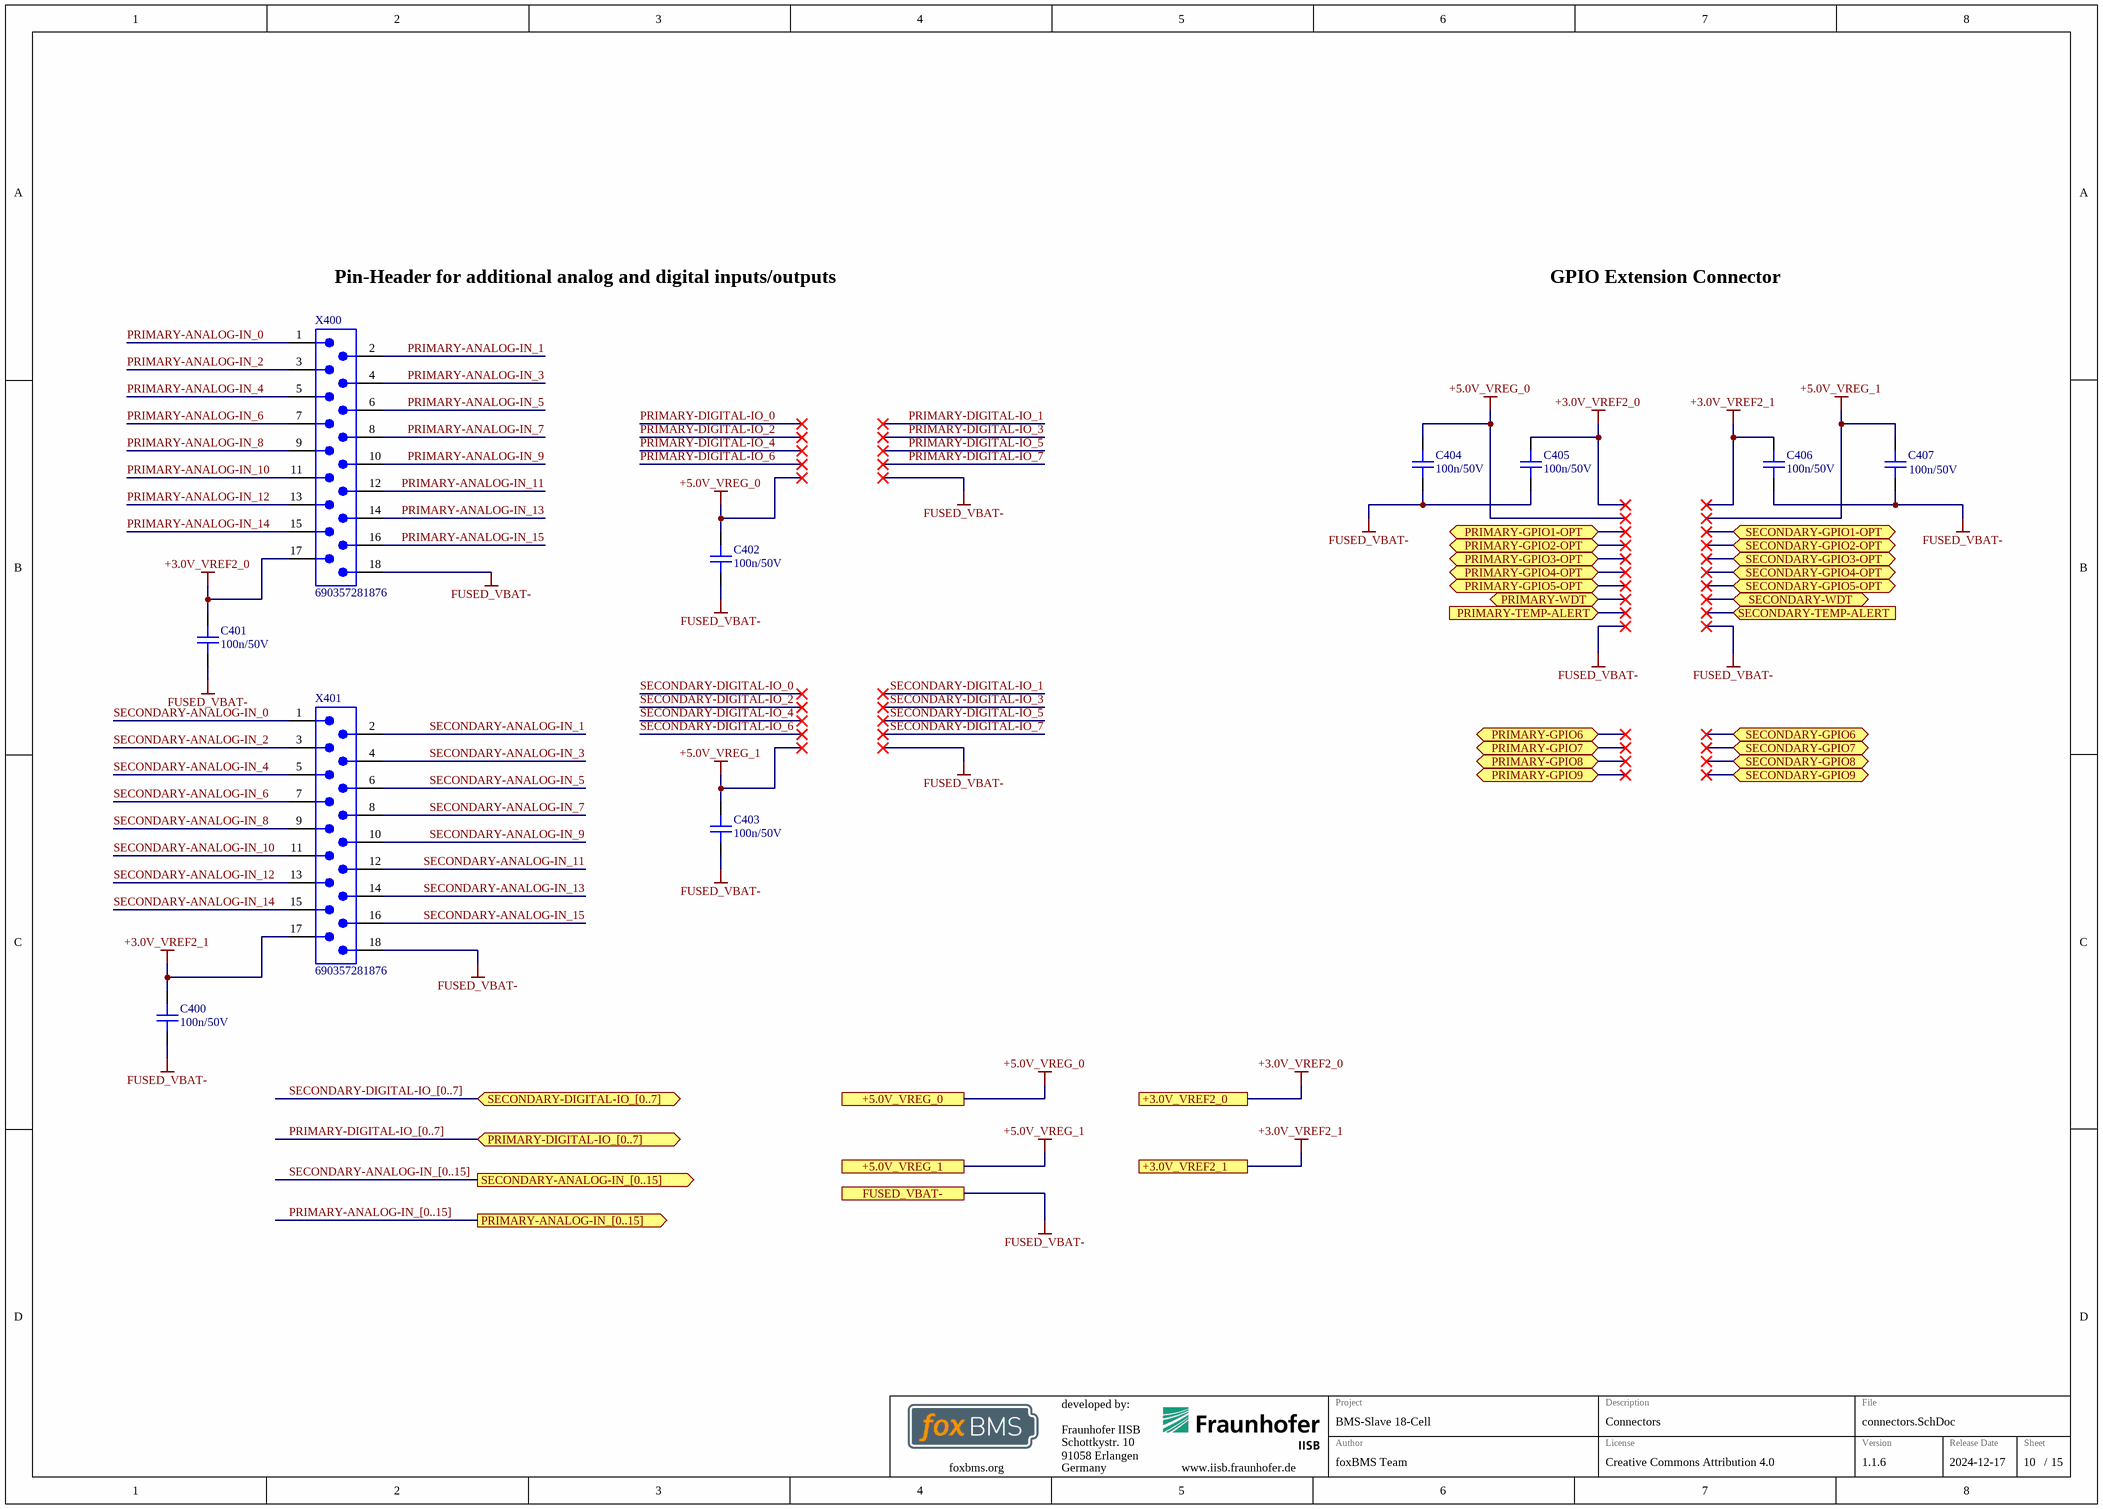
[diagram p4: connectors.SchDoc]

### Parts
C400  100n/50V  [CAPC1608X08N]
C401  100n/50V  [CAPC1608X08N]
C402  100n/50V  [CAPC1608X08N]
C403  100n/50V  [CAPC1608X08N]
C404  100n/50V  [CAPC1608X08N]
C405  100n/50V  [CAPC1608X08N]
C406  100n/50V  [CAPC1608X08N]
C407  100n/50V  [CAPC1608X08N]
X400  690357281876  [690357281876]
X401  690357281876  [690357281876]

### Ports
+3.0V_VREF2_0, +3.0V_VREF2_1, +5.0V_VREG_0, +5.0V_VREG_1, FUSED_VBAT-, PRIMARY-ANALOG-IN_[0..15] (out), PRIMARY-DIGITAL-IO_[0..7] (bidir), PRIMARY-GPIO1-OPT (bidir), PRIMARY-GPIO2-OPT (bidir), PRIMARY-GPIO3-OPT (bidir), PRIMARY-GPIO4-OPT (bidir), PRIMARY-GPIO5-OPT (bidir), PRIMARY-GPIO6 (bidir), PRIMARY-GPIO7 (bidir), PRIMARY-GPIO8 (bidir), PRIMARY-GPIO9 (bidir), PRIMARY-TEMP-ALERT (in), PRIMARY-WDT (bidir), SECONDARY-ANALOG-IN_[0..15] (out), SECONDARY-DIGITAL-IO_[0..7] (bidir), SECONDARY-GPIO1-OPT (bidir), SECONDARY-GPIO2-OPT (bidir), SECONDARY-GPIO3-OPT (bidir), SECONDARY-GPIO4-OPT (bidir), SECONDARY-GPIO5-OPT (bidir), SECONDARY-GPIO6 (bidir), SECONDARY-GPIO7 (bidir), SECONDARY-GPIO8 (bidir), SECONDARY-GPIO9 (bidir), SECONDARY-TEMP-ALERT (in), SECONDARY-WDT (bidir)

### Nets
+3.0V_VREF2_0: C401.2 C405.2 X400.17 ; port +3.0V_VREF2_0  [project net +3.0V_VREF2]
+3.0V_VREF2_1: C400.2 C406.2 X401.17 ; port +3.0V_VREF2_1  [project net +3.0V_VREF2]
+5.0V_VREG_0: C402.2 C404.2 ; port +5.0V_VREG_0  [project net +5.0V_VREG]
+5.0V_VREG_1: C403.2 C407.2 ; port +5.0V_VREG_1  [project net +5.0V_VREG]
FUSED_VBAT-: C400.1 C401.1 C402.1 C403.1 C404.1 C405.1 C406.1 C407.1 X400.18 X401.18 ; port FUSED_VBAT-
PRIMARY-ANALOG-IN_0: X400.1
PRIMARY-ANALOG-IN_1: X400.2
PRIMARY-ANALOG-IN_2: X400.3
PRIMARY-ANALOG-IN_3: X400.4
PRIMARY-ANALOG-IN_4: X400.5
PRIMARY-ANALOG-IN_5: X400.6
PRIMARY-ANALOG-IN_6: X400.7
PRIMARY-ANALOG-IN_7: X400.8
PRIMARY-ANALOG-IN_8: X400.9
PRIMARY-ANALOG-IN_9: X400.10
PRIMARY-ANALOG-IN_10: X400.11
PRIMARY-ANALOG-IN_11: X400.12
PRIMARY-ANALOG-IN_12: X400.13
PRIMARY-ANALOG-IN_13: X400.14
PRIMARY-ANALOG-IN_14: X400.15
PRIMARY-ANALOG-IN_15: X400.16
SECONDARY-ANALOG-IN_0: X401.1
SECONDARY-ANALOG-IN_1: X401.2
SECONDARY-ANALOG-IN_2: X401.3
SECONDARY-ANALOG-IN_3: X401.4
SECONDARY-ANALOG-IN_4: X401.5
SECONDARY-ANALOG-IN_5: X401.6
SECONDARY-ANALOG-IN_6: X401.7
SECONDARY-ANALOG-IN_7: X401.8
SECONDARY-ANALOG-IN_8: X401.9
SECONDARY-ANALOG-IN_9: X401.10
SECONDARY-ANALOG-IN_10: X401.11
SECONDARY-ANALOG-IN_11: X401.12
SECONDARY-ANALOG-IN_12: X401.13
SECONDARY-ANALOG-IN_13: X401.14
SECONDARY-ANALOG-IN_14: X401.15
SECONDARY-ANALOG-IN_15: X401.16

### Buses and harness runs
bus PRIMARY-ANALOG-IN_[0..15] = port PRIMARY-ANALOG-IN_[0..15]
bus PRIMARY-DIGITAL-IO_[0..7] = port PRIMARY-DIGITAL-IO_[0..7]
bus SECONDARY-ANALOG-IN_[0..15] = port SECONDARY-ANALOG-IN_[0..15]
bus SECONDARY-DIGITAL-IO_[0..7] = port SECONDARY-DIGITAL-IO_[0..7]

### Notes on the sheet
- Pin-Header for additional analog and digital inputs/outputs
- GPIO Extension Connector
- Fraunhofer IISB
- Schottkystr. 10
- developed by:
- 91058 Erlangen
- Germany
- Author
- Project
- License
- Description
- File
- Version
- Release Date
- Sheet
- foxbms.org <https://foxbms.org>
- www.iisb.fraunhofer.de <https://www.iisb.fraunhofer.de/>
- foxBMS Team
- /

### Library data of the parts
C400-C407 = gen_C_ceramic_100n_50V_X7R_0603: as C903 on sheet ext_supply; Part Number: gen_C_ceramic_100n_50V_X7R_0603; Supplier 1: Farnell; Supplier Part Number 1: 2525267; Supplier 2: Digikey; Supplier Part Number 2: 490-6049-1-ND; Supplier 3: Farnell; Supplier Part Number 3: 2070398
X400 X401 = CMP-1502-00896-2: NexarPartId: 65759599; Pitch: 2.54mm; Current Rating: 1.5A; Gender: Male; Operating Supply Voltage: 100V; Insulation Resistance: 1GΩ; Contact Resistance: 10mΩ; Min Operating Temperature: -40°C; Packaging: Tape and Reel; Lead Pitch: 2.54mm; Length: 23.69mm; RoHS: Compliant; Max Operating Temperature: 105°C; Number of Pins: 18